# Altium schematic sheet USB_OTG_FS.SchDoc: USB OTG FS
size A4; Author: N.P; CompanyName: STMicroelectronics; Organization: MCD/APPLIS/LMS; DocumentNumber: 9; SheetNumber: 9; SheetTotal: 13; Project: STM32F723e-DISCO
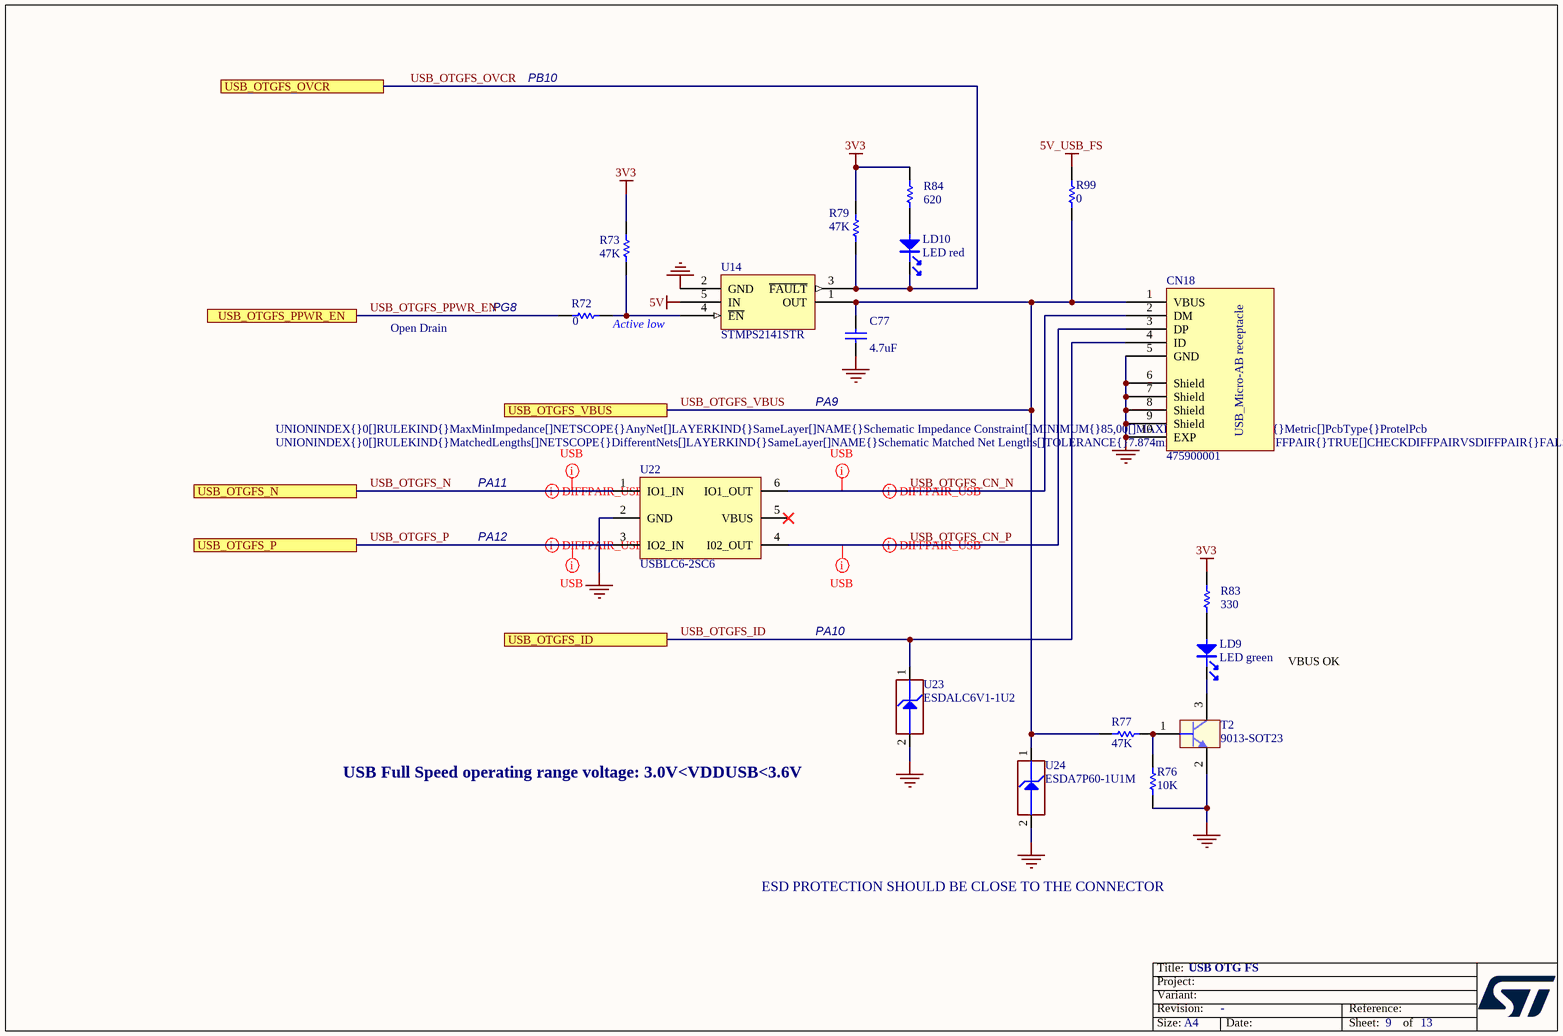
[diagram p0: USB_OTG_FS.SchDoc]

## Parts
C77  4.7uF  [0603C]
CN18  475900001  [MOLEX_47590001]
LD9  LED green  [0603D]
LD10  LED red  [0603D]
R72  value 0  [0603R-GS]  (hidden comment: 0_5%_0603)
R73  value 47K  [0402R]  (hidden comment: 47K_1%_0402)
R76  10K  [0402R]
R77  value 47K  [0402R]  (hidden comment: 47K_1%_0402)
R79  value 47K  [0402R]  (hidden comment: 47K_1%_0402)
R83  value 330  [0603R]  (hidden comment: 330_1%_0603)
R84  value 620  [0603R]  (hidden comment: 620_1%_0603)
R99  value 0  [0603R-GS]  (hidden comment: 0_5%_0603)
T2  9013-SOT23  [SOT-23]
U14  STMPS2141STR  [SOT23-5]
U22  USBLC6-2SC6  [SOT23-6]
U23  ESDALC6V1-1U2  [ESD_ST0201]
U24  ESDA7P60-1U1M  [ESD_ST0201]

## Ports
USB_OTGFS_ID, USB_OTGFS_N, USB_OTGFS_OVCR, USB_OTGFS_P, USB_OTGFS_PPWR_EN, USB_OTGFS_VBUS

## Nets
3V3: R73.2 R79.2 R83.2 R84.2
5V: U14.5(IN)
5V_USB_FS: R99.2
GND: C77.2 CN18.5(GND) CN18.6(Shield) CN18.7(Shield) CN18.8(Shield) CN18.9(Shield) CN18.10(EXP) R76.1 T2.2(E) U14.2(GND) U22.2(GND) U23.2(GND) U24.2(GND)
USB_OTGFS_CN_N: CN18.2(DM) U22.6(IO1_OUT)
USB_OTGFS_CN_P: CN18.3(DP) U22.4(I02_OUT)
USB_OTGFS_ID: CN18.4(ID) U23.1(IO1) ; port USB_OTGFS_ID
USB_OTGFS_N: U22.1(IO1_IN) ; port USB_OTGFS_N
USB_OTGFS_OVCR: LD10.2 R79.1 U14.3(~{FAULT}) ; port USB_OTGFS_OVCR
USB_OTGFS_P: U22.3(IO2_IN) ; port USB_OTGFS_P
USB_OTGFS_PPWR_EN: R72.1 ; port USB_OTGFS_PPWR_EN
USB_OTGFS_VBUS: C77.1 CN18.1(VBUS) R77.2 R99.1 U14.1(OUT) U24.1(IO1) ; port USB_OTGFS_VBUS
NetLD9_1: LD9.1 R83.1
NetLD9_2: LD9.2 T2.3(C)
NetLD10_1: LD10.1 R84.1
NetR72_2: R72.2 R73.1 U14.4(~{EN})
NetR76_2: R76.2 R77.1 T2.1(B)

Not connected (* = marked no-connect by the designer): U22 5(VBUS)*

## Layout directives
rule Undefined; rule Matched Net Lengths [Tolerance = 0.2mm]; rule Impedance Constraint [Min = 85.00    Max = 95.00    ]: USB_OTGFS_CN_N, USB_OTGFS_CN_P, USB_OTGFS_N, USB_OTGFS_P
differential pair; rule Impedance Constraint [Min = 85.00    Max = 95.00    ]: USB_OTGFS_CN_N, USB_OTGFS_CN_P, USB_OTGFS_N, USB_OTGFS_P

## Notes on the sheet
- PB10
- (near R72) PG8
- Open Drain
- (near R72) Active low
- PA9
- PA11
- PA12
- PA10
- VBUS OK
- USB Full Speed operating range voltage: 3.0V<VDDUSB<3.6V
- ESD PROTECTION SHOULD BE CLOSE TO THE CONNECTOR
- Title:
- Project:
- Size:
- Revision:
- Variant:
- A4
- -
- Date:
- Reference:
- Sheet:
- of
- (in symbol 475900001) USB_Micro-AB receptacle

## Library data of the parts
C77 = Cap_4.7uF_X5R_10%_0603: Capacitor,4.7uF,16V, X5R,10%,0603,YAGEO; Manuf_Part_1: CC0603KRX5R7BB475; Order: CC0603KRX5R7BB105; Ordered by: Subcon; Fitted: YES; Revision: July-2002: Re-released for DXP Platform.; Value: 4.7uF; Manuf_1: YAGEO; ECCN_US/EU: n/a
CN18 = 475900001: USB-MICRO-AB, 47590-0001, SMT, MOLEX; Ordered by: Subcon; Fitted: YES; Manuf_Part_1: 47590-0001; Manuf_1: MOLEX; ECCN_US/EU: n/a
LD9 = LED_green: LED green 0603; Manuf_1: everlight; Manuf_Part_1: 19-213SYGC/S530-E2/TR8; Ordered by: Subcon; Fitted: YES; Order: 19-213SYGC/S530-E2/TR8; ECCN_US/EU: n/a
LD10 = LED_red: LED red 0603; Manuf_1: everlight; Manuf_Part_1: 19-213-R6C-AP1Q2B/3T; Ordered by: Subcon; Fitted: YES; Order: 19-213-R6C-AP1Q2B/3T; ECCN_US/EU: n/a
R72 R99 = Res_0_5%_0603: Resistor,0,0603,5%,YAGEO; Manuf_Part_1: RC0603JR-070RL; Order: 2363481; Ordered by: Subcon; Fitted: YES; ECCN_US/EU: n/a; Manuf_1: YAGEO; Distrib: FARNELL
R73 R77 R79 = Res_47K_1%_0402: Resistor,47K,0402,1%,YAGEO; Manuf_Part_1: RC0402FR-0747KL; Order: 9239430; Ordered by: Subcon; Fitted: YES; Manuf_1: YAGEO; ECCN_US/EU: n/a; Distrib: FARNELL
R76 = Res_10K_1%_0402: Resistor,10K,0402,1%,YAGEO; Manuf_Part_1: RC0402FR-0710KL; Ordered by: Subcon; Fitted: YES; Value: 10K; Manuf_1: YAGEO; Order: RC0402FR-0710KL; ECCN_US/EU: n/a
R83 = Res_330_1%_0603: Resistor,330,0603,1%,YAGEO; Manuf_Part_1: RC0603FR-07330RL; Manuf_Part_2: RT0603FRE07330RL; Ordered by: Subcon; Fitted: YES; ECCN_US/EU: n/a; Manuf_1: YAGEO; Distrib: FARNELL; Manuf_2: YAGEO
R84 = Res_620_1%_0603: Resistor,620,0603,1%,VISHAY; Manuf_Part_1: CRCW0603620RFKEA; Manuf_1: VISHAY DRALORIC; Order: 2122341; Ordered by: Subcon; Fitted: YES; ECCN_US/EU: n/a; Distrib: FARNELL
T2 = 9013-SOT23: NPN Bipolar Transistor; Manuf_1: NXP; Manuf_Part_1: BSR14; Order: 1081310; Ordered by: Subcon; Fitted: YES; Revision: July-2002: Re-released for DXP Platform.; Distrib: FARNELL; ECCN_US/EU: n/a
U14 = STMPS2141STR: Enhanced single channel power switches; Manuf_1: STM; Provided: ST; ECCN_US/EU: EAR99/NEC; Ref St: 9159003; Fitted: YES; Order: STMPS2141STR; Manuf_Part_1: STMPS2141STR; Distrib: ST; Ordered by: ST
U22 = USBLC6-2SC6: Very low capacitance ESD protection; Manuf_1: STM; Provided: ST; ECCN_US/EU: EAR99/NEC; Fitted: YES; Manuf_Part_1: USBLC6-2SC6; Distrib: ST; Ordered by: ST
U23 = ESDALC6V1-1U2: Dual Transil array for ESD protection; Manuf_1: STM; Ref St: .; ECCN_US/EU: EAR99/NEC; Fitted: YES; Provided: ST; Manuf_Part_1: ESDALC6V1-1U2; Distrib: ST; Ordered_By: STM; Order: ESDALC6V1-1U2
U24 = MCD-00251: High power transient voltage suppressor, 7V breakdown; Manuf_1: STM; ECCN_US/EU: EAR99/NEC; Fitted: YES; Manuf_Part_1: ESDA7P60-1U1M; Ordered_By: STM; Value: ESDA7P60-1U1M; Internal_Part_Number: MCD-00251; PartType: ICS; Manufacturer_Part_Number_1: ESDA7P60-1U1M; Manufacturer_1: STM; ComponentLink1URL: ST_ESDA7P60-1U1M.pdf; Provided_By: STM